# Altium schematic sheet gydrodrive_sto.SchDoc
size 297 x 209 mm; SheetNumber: 12; SheetTotal: 22
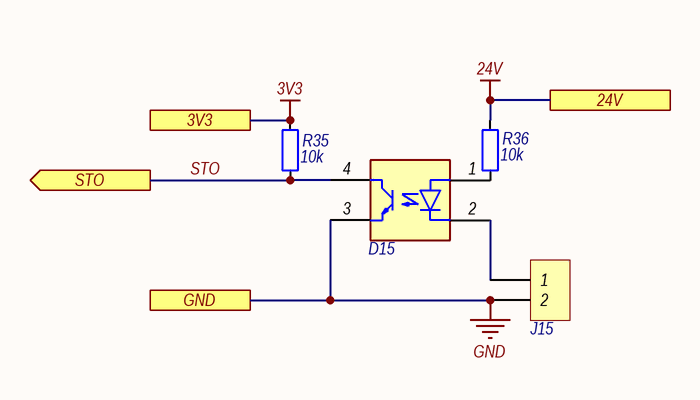
[diagram p0: gydrodrive_sto.SchDoc]

## Parts
D15  LTV-817S  [DIP-4-SMD]  (value not drawn)
J15  DG142V-5.08-02P  [DG142V-5.08-02P]  (value not drawn)
R35  Resistance: 10k  [RESC2012-0805M]  (hidden comment: RES_0805)
R36  Resistance: 10k  [RESC2012-0805M]  (hidden comment: RES_0805)

## Ports
3V3 (see gydrodrive_main[4C], gydrodrive_button[3B], gydrodrive_can[3B], gydrodrive_debugger[3B], gydrodrive_encoder[1A], gydrodrive_indication[4C], gydrodrive_inputTrim[4B], gydrodrive_interfaces[3C], gydrodrive_mcu[4C], gydrodrive_rs485[4B], gydrodrive_supply[5B]), 24V (see gydrodrive_main[4C], gydrodrive_button[4B], gydrodrive_control[4B], gydrodrive_currentSource[2B], gydrodrive_discreteControl[4B], gydrodrive_encoder[3B], gydrodrive_linearPosSensor[3B], gydrodrive_sensor[3B], gydrodrive_sensors[2B], gydrodrive_supply[2B]), GND (see gydrodrive_main[4C], gydrodrive_button[3C], gydrodrive_can[3C], gydrodrive_control[3B], gydrodrive_currentSource[2B], gydrodrive_debugger[4C], gydrodrive_discreteControl[3B], gydrodrive_encoder[1B], gydrodrive_i2c[5C], gydrodrive_indication[4C], gydrodrive_inputTrim[4C], gydrodrive_interfaces[3A], gydrodrive_linearPosSensor[2C], gydrodrive_mcu[6D], gydrodrive_reservedPins[2C], gydrodrive_rs485[3B], gydrodrive_sensor[3C], gydrodrive_sensors[2B], gydrodrive_supply[2C], gydrodrive_uart[4C]), STO (out, see gydrodrive_main[3C], gydrodrive_mcu[6B])

## Nets
3V3: R35.2 ; port 3V3
24V: R36.2 ; port 24V
GND: D15.3(C) J15.2 ; port GND
STO: D15.4(A) R35.1 ; port STO
NetD15_1: D15.1(K) R36.1
NetD15_2: D15.2(E) J15.1

## Notes on the sheet
- Подп. и дата
- Инв. № дубл.
- Взам. инв. №
- Инв. № подл.
- Изм.
- Лист
- № докум.
- Подп.
- Дата
- Копировал
- Формат
- A4

## Library data of the parts
D15 = LTV-817S: Оптопара транзисторная одноканальная; Part Name: Оптопара транзисторная LTV-817S; Max Price: 50; Part Number: LTV-817S; Component Type: Standart
J15 = DG142V-5.08-02P: Клеммник 2-контактный, шаг 5.08 мм; Part Name: Клеммник DG142V-5.08-02P; Parameters: 8А; Max Price: 60; System: Connector; Part Number: DG142V-5.08-02P; Component Type: Standart; Pin Count: 2
R35 R36 = RESC_0805: Рез-р, корпус 0805; Tolerance: 5%; Parameters: 10k, 5%; Max Price: 3; Part Number: RESC_0805; Part Name: ='Рез-р 0805, ' + Parameters; Component Type: Standart